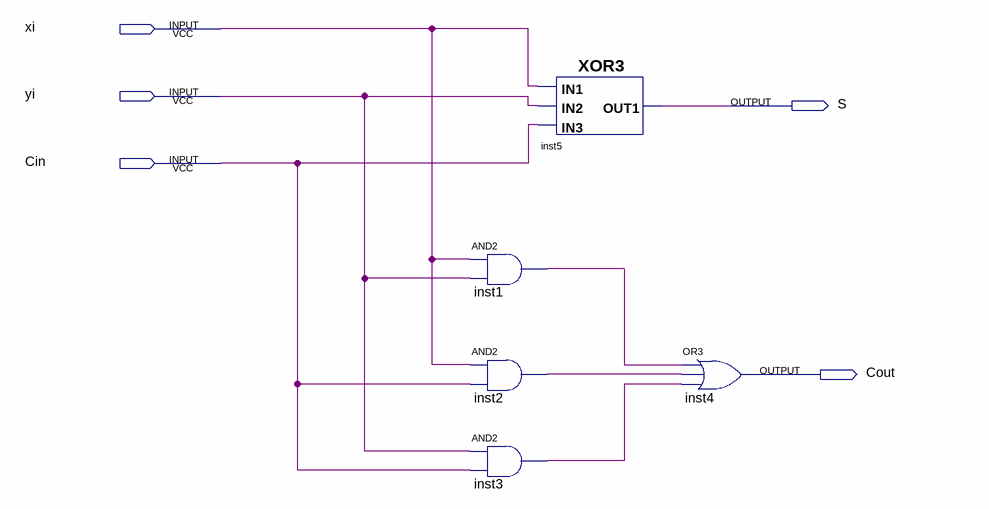
[diagram p0: schematic sheet]
// Quartus schematic full_adder.bdf as structural Verilog: 5 symbols, 5 pins
module full_adder (
  input  xi,
  input  yi,
  input  Cin,
  output S,
  output Cout
);

  wire inst1_out, inst2_out, inst3_out;

  XOR3 inst5 (.IN3(Cin), .IN1(xi), .IN2(yi), .OUT1(S));
  and inst1 (inst1_out, xi, yi);
  and inst2 (inst2_out, xi, Cin);
  and inst3 (inst3_out, yi, Cin);
  or inst4 (Cout, inst1_out, inst2_out, inst3_out);
endmodule
